# EAGLE design INK_TIME (EAGLE 9.7.0)

## Sheet 1 of 2
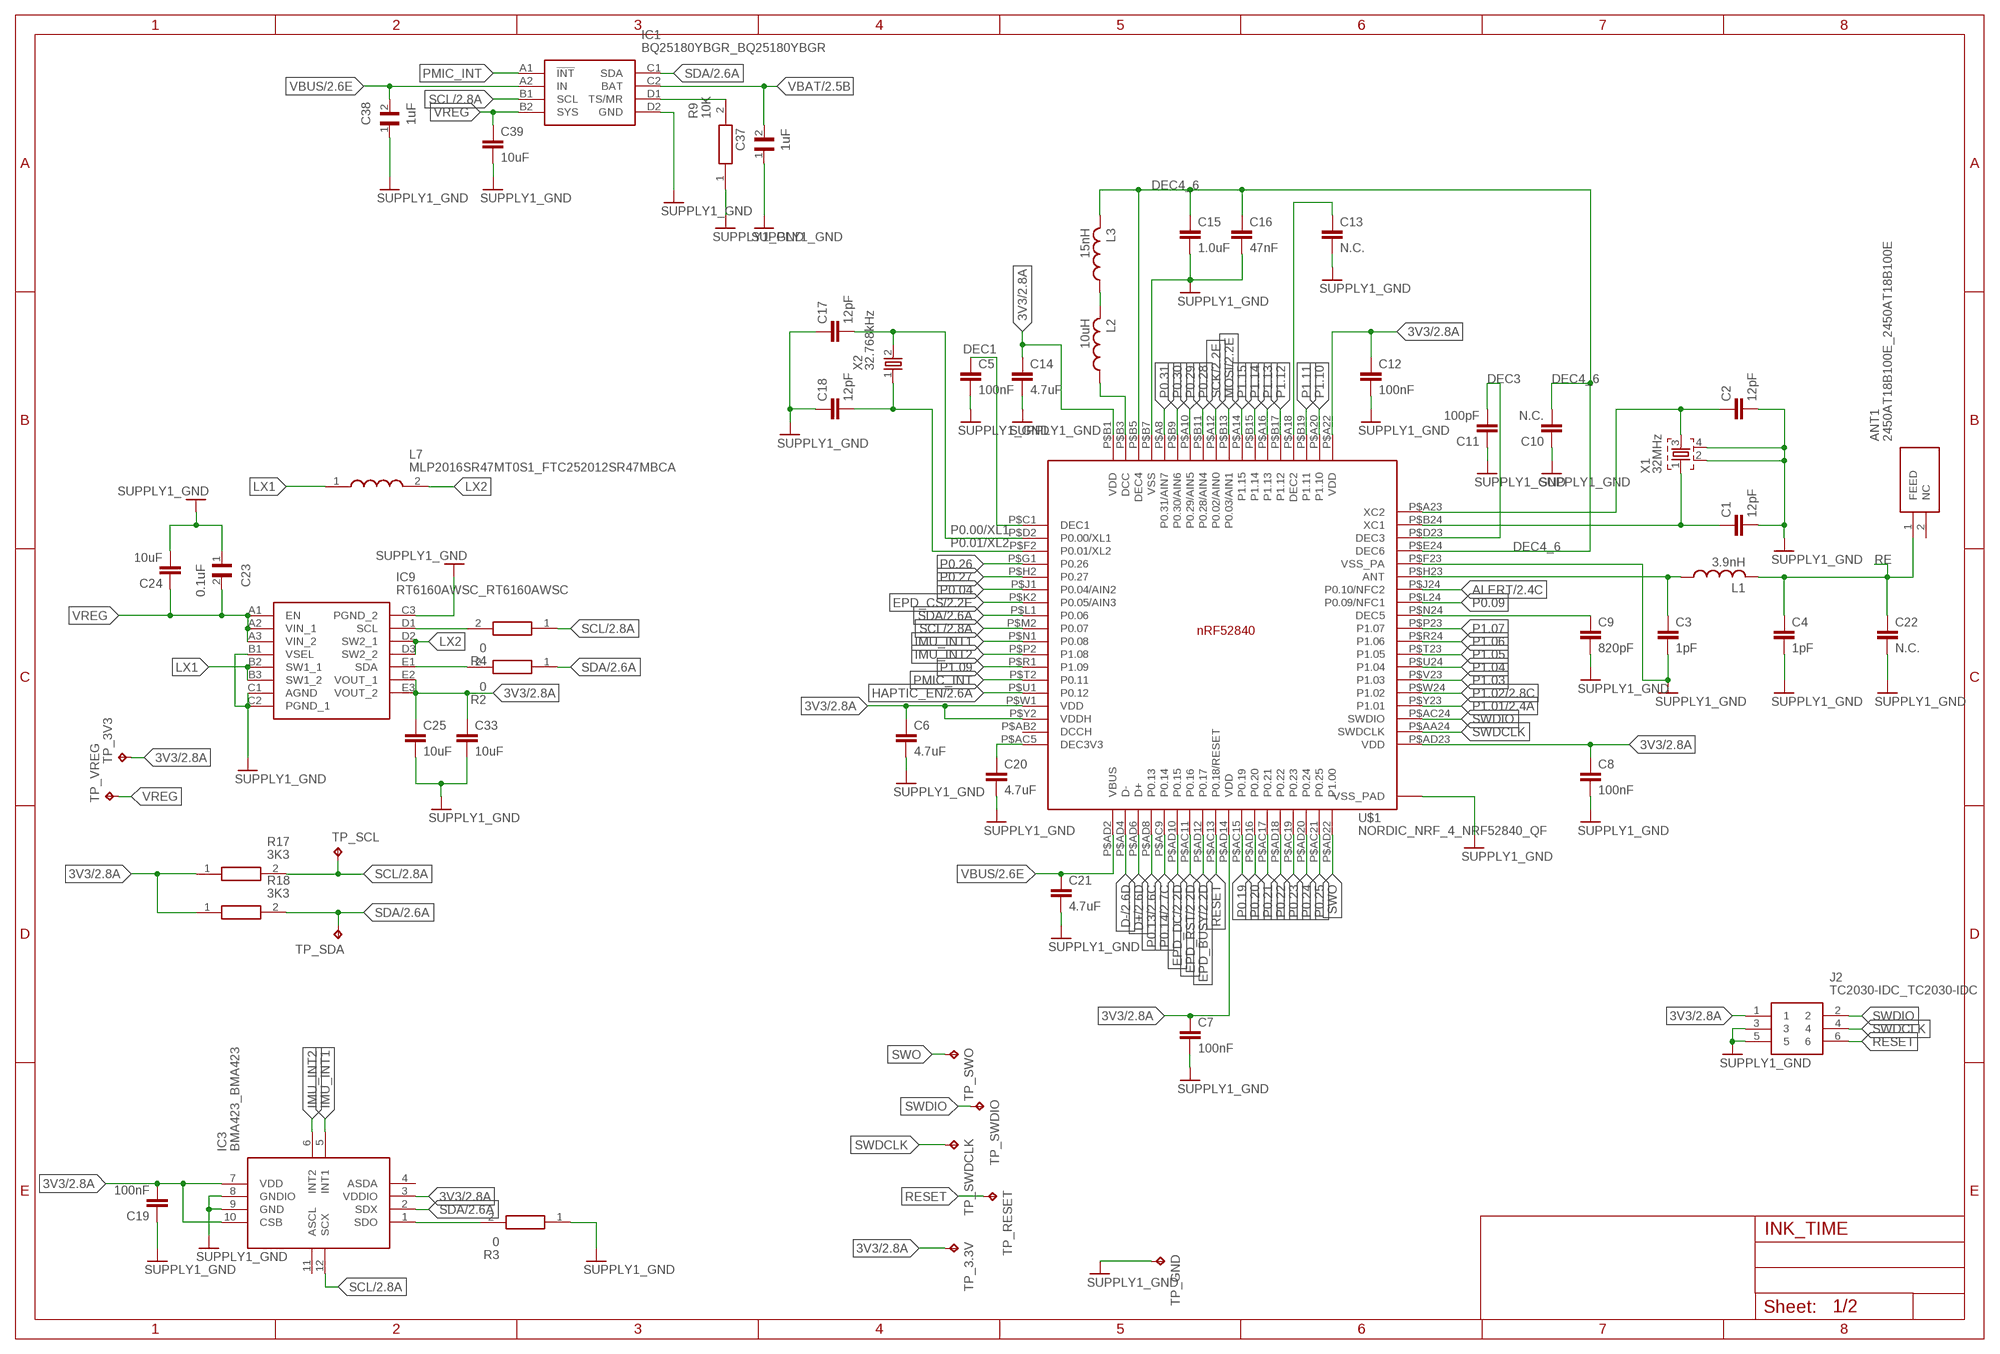
[diagram p0: schematic, sheet 1]

### Parts
ANT1  2450AT18B100E_2450AT18B100E  [2450AT18B100E_ANTC3216X140N]
C1  12pF  NORDIC_NRF_3_CAPACITOR_0201_L  [NORDIC_NRF_3_RESC0201_L]
C2  12pF  NORDIC_NRF_3_CAPACITOR_0201_L  [NORDIC_NRF_3_RESC0201_L]
C3  1pF  NORDIC_NRF_3_CAPACITOR_0201_L  [NORDIC_NRF_3_RESC0201_L]
C4  1pF  NORDIC_NRF_3_CAPACITOR_0201_L  [NORDIC_NRF_3_RESC0201_L]
C5  100nF  NORDIC_NRF_3_CAPACITOR_0201_L  [NORDIC_NRF_3_RESC0201_L]
C6  4.7uF  NORDIC_NRF_3_CAPACITOR_0402_L  [NORDIC_NRF_3_RESC0402_L]
C7  100nF  NORDIC_NRF_3_CAPACITOR_0201_L  [NORDIC_NRF_3_RESC0201_L]
C8  100nF  NORDIC_NRF_3_CAPACITOR_0201_L  [NORDIC_NRF_3_RESC0201_L]
C9  820pF  NORDIC_NRF_3_CAPACITOR_0201_L  [NORDIC_NRF_3_RESC0201_L]
C10  N.C.  NORDIC_NRF_3_CAPACITOR_0201_L  [NORDIC_NRF_3_RESC0201_L]
C11  100pF  NORDIC_NRF_3_CAPACITOR_0201_L  [NORDIC_NRF_3_RESC0201_L]
C12  100nF  NORDIC_NRF_3_CAPACITOR_0201_L  [NORDIC_NRF_3_RESC0201_L]
C13  N.C.  NORDIC_NRF_3_CAPACITOR_0201_L  [NORDIC_NRF_3_RESC0201_L]
C14  4.7uF  NORDIC_NRF_3_CAPACITOR_0402_L  [NORDIC_NRF_3_RESC0402_L]
C15  1.0uF  NORDIC_NRF_3_CAPACITOR_0402_L  [NORDIC_NRF_3_RESC0402_L]
C16  47nF  NORDIC_NRF_3_CAPACITOR_0201_L  [NORDIC_NRF_3_RESC0201_L]
C17  12pF  NORDIC_NRF_3_CAPACITOR_0201_L  [NORDIC_NRF_3_RESC0201_L]
C18  12pF  NORDIC_NRF_3_CAPACITOR_0201_L  [NORDIC_NRF_3_RESC0201_L]
C19  100nF  NORDIC_NRF_3_CAPACITOR_0201_L  [NORDIC_NRF_3_RESC0201_L]
C20  4.7uF  NORDIC_NRF_3_CAPACITOR_0402_L  [NORDIC_NRF_3_RESC0402_L]
C21  4.7uF  NORDIC_NRF_3_CAPACITOR_0402_L  [NORDIC_NRF_3_RESC0402_L]
C22  N.C.  NORDIC_NRF_3_CAPACITOR_0201_L  [NORDIC_NRF_3_RESC0201_L]
C23  0.1uF  GRM011R60J152KE01L_1_GRM011R60J152KE01L  [GRM011R60J152KE01L_1_0201]
C24  10uF  NORDIC_NRF_3_CAPACITOR_0402_L  [NORDIC_NRF_3_RESC0402_L]
C25  10uF  NORDIC_NRF_3_CAPACITOR_0402_L  [NORDIC_NRF_3_RESC0402_L]
C33  10uF  NORDIC_NRF_3_CAPACITOR_0402_L  [NORDIC_NRF_3_RESC0402_L]
C37  1uF  GRM011R60J152KE01L_1_GRM011R60J152KE01L  [GRM011R60J152KE01L_1_0201]
C38  1uF  GRM011R60J152KE01L_1_GRM011R60J152KE01L  [GRM011R60J152KE01L_1_0201]
C39  10uF  NORDIC_NRF_3_CAPACITOR_0402_L  [NORDIC_NRF_3_RESC0402_L]
IC1  BQ25180YBGR_BQ25180YBGR  [BQ25180YBGR_BGA8C40P2X4_100X155X50]
IC3  BMA423_BMA423  [BMA423_BMA423]
IC9  RT6160AWSC_RT6160AWSC  [RT6160AWSC_BGA15C40P3X5_140X230X60]
J2  TC2030-IDC_TC2030-IDC  [TC2030-IDC_TC2030IDC]
L1  3.9nH  NORDIC_NRF_2_INDUCTOR_0402_L  [NORDIC_NRF_2_RESC0402_L]
L2  10uH  NORDIC_NRF_2_INDUCTOR_0402_L  [NORDIC_NRF_2_RESC0402_L]
L3  15nH  NORDIC_NRF_2_INDUCTOR_0402_L  [NORDIC_NRF_2_RESC0402_L]
L7  MLP2016SR47MT0S1_FTC252012SR47MBCA  [MLP2016SR47MT0S1_INDC2016X100N]
R2  0  CPF0201D7K68C1_CPF0201D7K68C1  [CPF0201D7K68C1_0201]
R3  0  CPF0201D7K68C1_CPF0201D7K68C1  [CPF0201D7K68C1_0201]
R4  0  CPF0201D7K68C1_CPF0201D7K68C1  [CPF0201D7K68C1_0201]
R9  10K  CPF0201D7K68C1_CPF0201D7K68C1  [CPF0201D7K68C1_0201]
R17  3K3  CPF0201D7K68C1_CPF0201D7K68C1  [CPF0201D7K68C1_0201]
R18  3K3  CPF0201D7K68C1_CPF0201D7K68C1  [CPF0201D7K68C1_0201]
TP_3.3V  HECTOR_WATCH_1_TPTP20R  [HECTOR_WATCH_1_TP20R]
TP_3V3  HECTOR_WATCH_1_TPTP20R  [HECTOR_WATCH_1_TP20R]
TP_GND  HECTOR_WATCH_1_TPTP20R  [HECTOR_WATCH_1_TP20R]
TP_RESET  HECTOR_WATCH_1_TPTP20R  [HECTOR_WATCH_1_TP20R]
TP_SCL  HECTOR_WATCH_1_TPTP20R  [HECTOR_WATCH_1_TP20R]
TP_SDA  HECTOR_WATCH_1_TPTP20R  [HECTOR_WATCH_1_TP20R]
TP_SWDCLK  HECTOR_WATCH_1_TPTP20R  [HECTOR_WATCH_1_TP20R]
TP_SWDIO  HECTOR_WATCH_1_TPTP20R  [HECTOR_WATCH_1_TP20R]
TP_SWO  HECTOR_WATCH_1_TPTP20R  [HECTOR_WATCH_1_TP20R]
TP_VREG  HECTOR_WATCH_1_TPTP20R  [HECTOR_WATCH_1_TP20R]
U$1  NORDIC_NRF_4_NRF52840_QF  [NORDIC_NRF_4_AQFN50P700X700X85_HS-74N]
X1  32MHz  NORDIC_NRF_XTAL_32MHZ  [NORDIC_NRF_BT-XTAL_2016_N]
X2  32.768kHz  NORDIC_NRF_1_XTAL_32KHZ  [NORDIC_NRF_1_XTAL_3215_N]

### Nets
3V3: C6.1 C7.1 C8.1 C12.1 C14.1 C19.2 C25.1 C33.1 IC3.3(VDDIO) IC3.7(VDD) IC3.10(CSB) IC9.E2(VOUT_1) IC9.E3(VOUT_2) J2.1 R17.1 R18.1 TP_3.3V.TP TP_3V3.TP U$1.P$A22(VDD) U$1.P$AD14(VDD) U$1.P$AD23(VDD) U$1.P$B1(VDD) U$1.P$W1(VDD) U$1.P$Y2(VDDH) ; also sheet 2
ALERT: U$1.P$J24(P0.10/NFC2) ; also sheet 2
D+: U$1.P$AD6(D+) ; also sheet 2
D-: U$1.P$AD4(D-) ; also sheet 2
DEC1: C5.1 U$1.P$C1(DEC1)
DEC3: C11.2 U$1.P$D23(DEC3)
DEC4_6: C10.2 C15.1 C16.1 L3.2 U$1.P$B5(DEC4) U$1.P$E24(DEC6)
EPD_BUSY: U$1.P$AD12(P0.17) ; also sheet 2
EPD_CS: U$1.P$K2(P0.05/AIN3) ; also sheet 2
EPD_DC: U$1.P$AD10(P0.15) ; also sheet 2
EPD_RST: U$1.P$AC11(P0.16) ; also sheet 2
GND: C1.2 C2.2 C3.2 C4.2 C5.2 C6.2 C7.2 C8.2 C9.2 C10.1 C11.1 C12.2 C13.2 C14.2 C15.2 C16.2 C17.1 C18.1 C19.1 C20.2 C21.2 C22.2 C23.1 C24.2 C25.2 C33.2 C37.1 C38.1 C39.2 IC1.D2(GND) IC3.8(GNDIO) IC3.9(GND) IC9.B1(VSEL) IC9.C1(AGND) IC9.C2(PGND_1) IC9.C3(PGND_2) J2.3 J2.5 R3.1 R9.1 TP_GND.TP U$1.P$74(VSS_PAD) U$1.P$75(VSS_PAD) U$1.P$76(VSS_PAD) U$1.P$77(VSS_PAD) U$1.P$78(VSS_PAD) U$1.P$79(VSS_PAD) U$1.P$80(VSS_PAD) U$1.P$81(VSS_PAD) U$1.P$82(VSS_PAD) U$1.P$83(VSS_PAD) U$1.P$84(VSS_PAD) U$1.P$85(VSS_PAD) U$1.P$86(VSS_PAD) U$1.P$87(VSS_PAD) U$1.P$88(VSS_PAD) U$1.P$89(VSS_PAD) U$1.P$90(VSS_PAD) U$1.P$B7(VSS) U$1.P$F23(VSS_PA) X1.2 X1.4 ; supply symbol labelled SUPPLY1_GND ; also sheet 2
HAPTIC_EN: U$1.P$U1(P0.12) ; also sheet 2
IMU_INT1: IC3.5(INT1) U$1.P$N1(P0.08)
IMU_INT2: IC3.6(INT2) U$1.P$P2(P1.08)
LX1: IC9.B2(SW1_1) IC9.B3(SW1_2) L7.1
LX2: IC9.D2(SW2_1) IC9.D3(SW2_2) L7.2
MOSI: U$1.P$B13(P0.03/AIN1) ; also sheet 2
N$1: C1.1 U$1.P$B24(XC1) X1.1
N$2: C2.1 U$1.P$A23(XC2) X1.3
N$3: IC1.D1(TS/MR) R9.2
N$4: IC9.D1(SCL) R4.2
N$5: C3.1 L1.1 U$1.P$H23(ANT)
N$6: C20.1 U$1.P$AC5(DEC3V3)
N$7: L2.1 U$1.P$B3(DCC)
N$8: C9.1 U$1.P$N24(DEC5)
N$9: IC9.E1(SDA) R2.2
N$10: IC3.1(SDO) R3.2
N$11: L2.2 L3.1
N$21: C13.1 U$1.P$A18(DEC2)
P0.00/XL1: C17.2 U$1.P$D2(P0.00/XL1) X2.2
P0.01/XL2: C18.2 U$1.P$F2(P0.01/XL2) X2.1
P0.04: U$1.P$J1(P0.04/AIN2)
P0.09: U$1.P$L24(P0.09/NFC1)
P0.13: U$1.P$AD8(P0.13) ; also sheet 2
P0.14: U$1.P$AC9(P0.14) ; also sheet 2
P0.19: U$1.P$AC15(P0.19)
P0.20: U$1.P$AD16(P0.20)
P0.21: U$1.P$AC17(P0.21)
P0.22: U$1.P$AD18(P0.22)
P0.23: U$1.P$AC19(P0.23)
P0.24: U$1.P$AD20(P0.24)
P0.25: U$1.P$AC21(P0.25)
P0.26: U$1.P$G1(P0.26)
P0.27: U$1.P$H2(P0.27)
P0.28: U$1.P$B11(P0.28/AIN4)
P0.29: U$1.P$A10(P0.29/AIN5)
P0.30: U$1.P$B9(P0.30/AIN6)
P0.31: U$1.P$A8(P0.31/AIN7)
P1.01: U$1.P$Y23(P1.01) ; also sheet 2
P1.02: U$1.P$W24(P1.02) ; also sheet 2
P1.03: U$1.P$V23(P1.03)
P1.04: U$1.P$U24(P1.04)
P1.05: U$1.P$T23(P1.05)
P1.06: U$1.P$R24(P1.06)
P1.07: U$1.P$P23(P1.07)
P1.09: U$1.P$R1(P1.09)
P1.10: U$1.P$A20(P1.10)
P1.11: U$1.P$B19(P1.11)
P1.12: U$1.P$B17(P1.12)
P1.13: U$1.P$A16(P1.13)
P1.14: U$1.P$B15(P1.14)
P1.15: U$1.P$A14(P1.15)
PMIC_INT: IC1.A1(!INT) U$1.P$T2(P0.11)
RE: ANT1.1(FEED) C4.1 C22.1 L1.2
RESET: J2.6 TP_RESET.TP U$1.P$AC13(P0.18/RESET)
SCK: U$1.P$A12(P0.02/AIN0) ; also sheet 2
SCL: IC1.B1(SCL) IC3.12(SCX) R4.1 R17.2 TP_SCL.TP U$1.P$M2(P0.07) ; also sheet 2
SDA: IC1.C1(SDA) IC3.2(SDX) R2.1 R18.2 TP_SDA.TP U$1.P$L1(P0.06) ; also sheet 2
SWDCLK: J2.4 TP_SWDCLK.TP U$1.P$AA24(SWDCLK)
SWDIO: J2.2 TP_SWDIO.TP U$1.P$AC24(SWDIO)
SWO: TP_SWO.TP U$1.P$AD22(P1.00)
VBAT: C37.2 IC1.C2(BAT) ; also sheet 2
VBUS: C21.1 C38.2 IC1.A2(IN) U$1.P$AD2(VBUS) ; also sheet 2
VREG: C23.2 C24.1 C39.1 IC1.B2(SYS) IC9.A1(EN) IC9.A2(VIN_1) IC9.A3(VIN_2) TP_VREG.TP
Unconnected: ANT1.2(NC) IC3.4(ASDA) IC3.11(ASCL) U$1.P$AB2(DCCH)

## Sheet 2 of 2
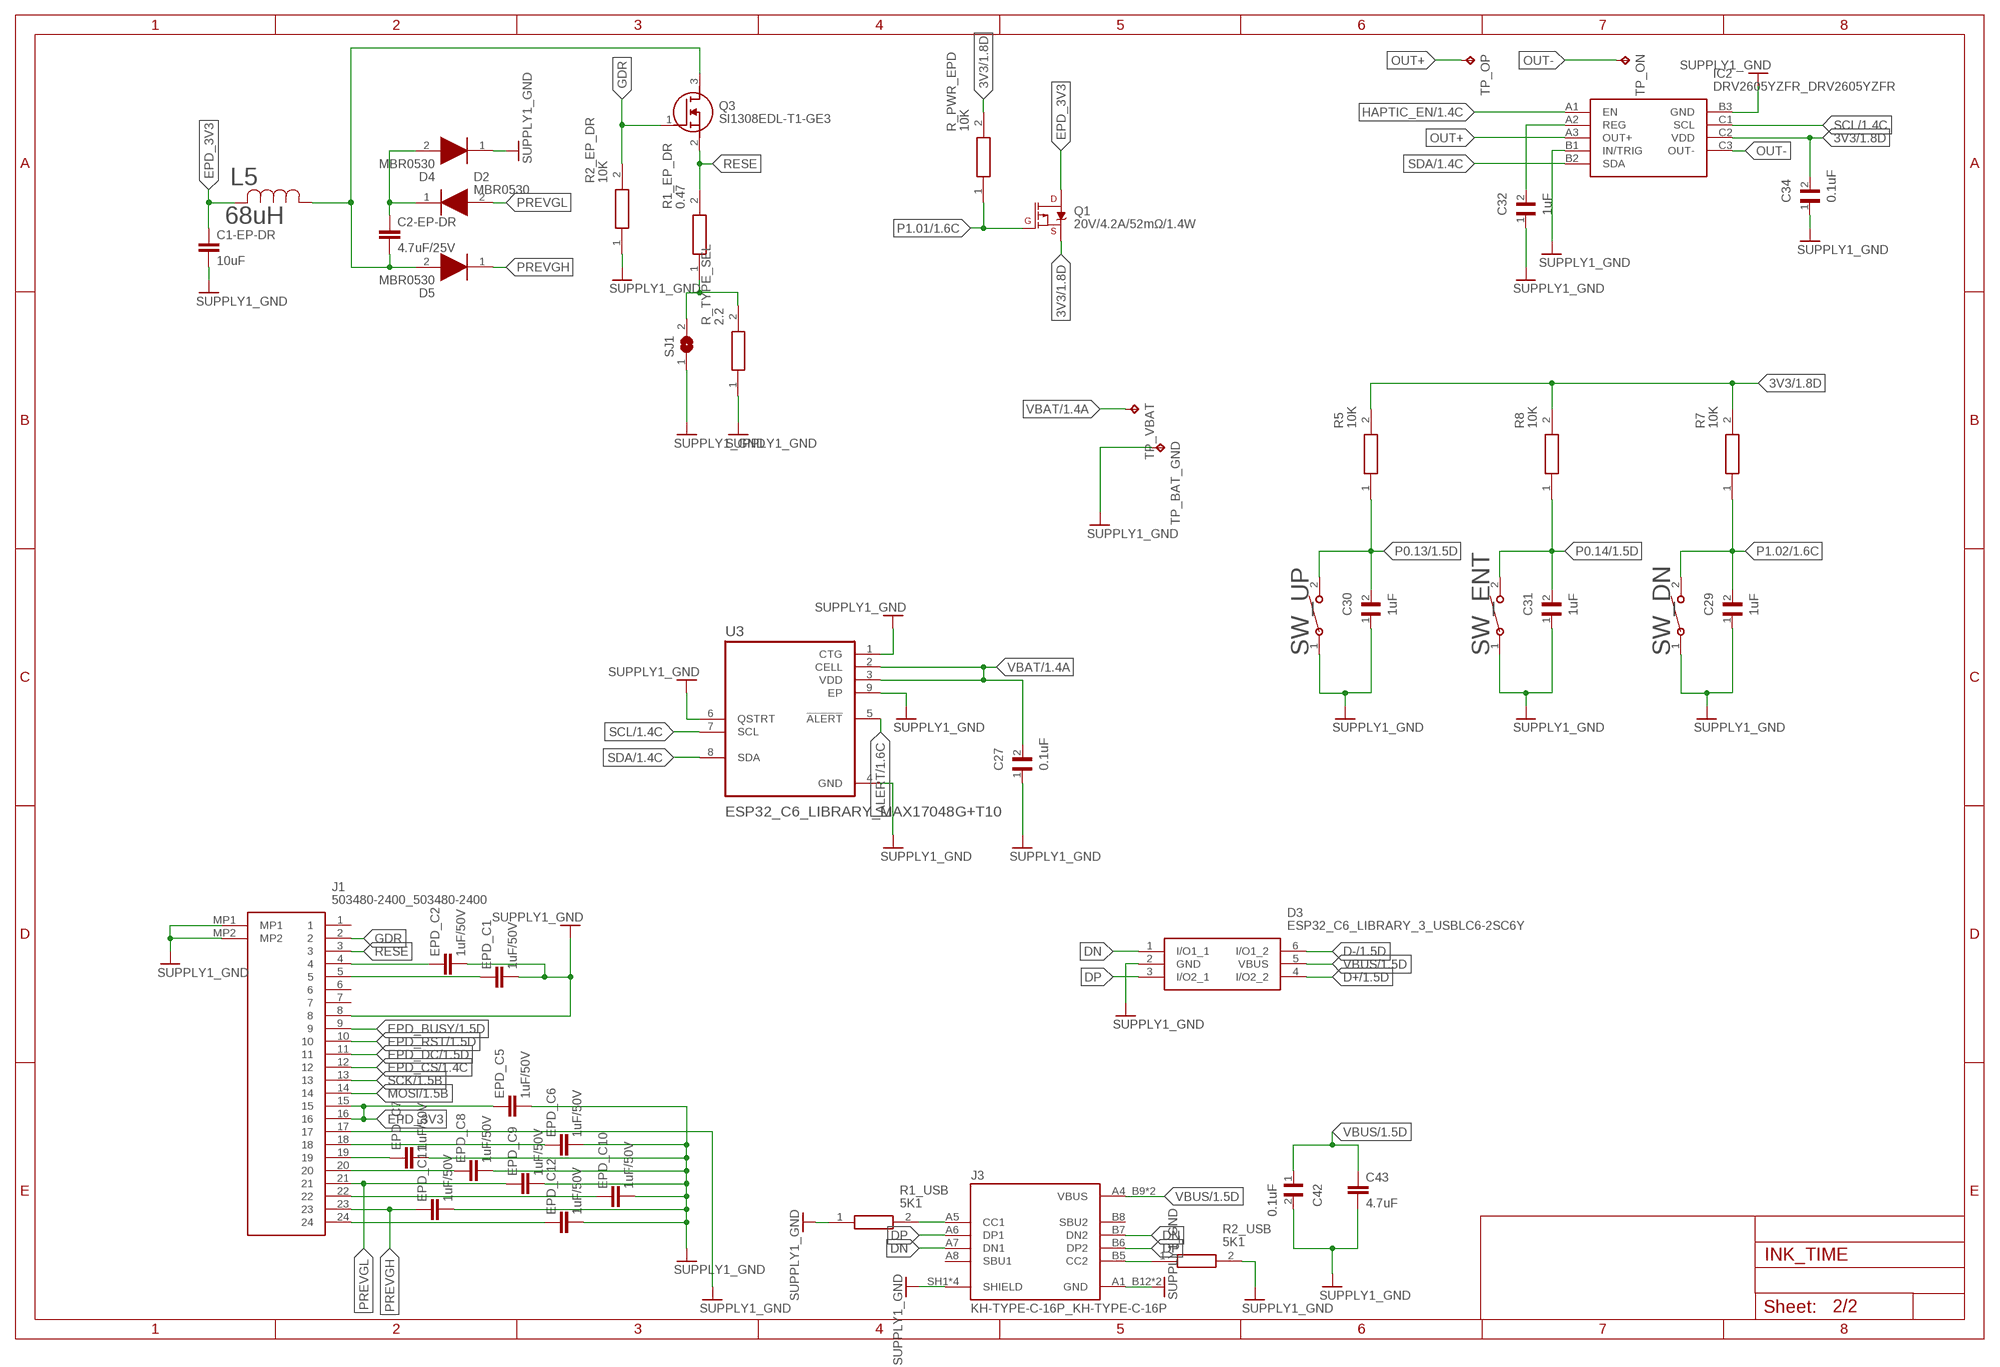
[diagram p1: schematic, sheet 2]

### Parts
C1-EP-DR  10uF  NORDIC_NRF_3_CAPACITOR_0402_L  [NORDIC_NRF_3_RESC0402_L]
C2-EP-DR  4.7uF/25V  NORDIC_NRF_3_CAPACITOR_0402_L  [NORDIC_NRF_3_RESC0402_L]
C27  0.1uF  GRM011R60J152KE01L_1_GRM011R60J152KE01L  [GRM011R60J152KE01L_1_0201]
C29  1uF  GRM011R60J152KE01L_1_GRM011R60J152KE01L  [GRM011R60J152KE01L_1_0201]
C30  1uF  GRM011R60J152KE01L_1_GRM011R60J152KE01L  [GRM011R60J152KE01L_1_0201]
C31  1uF  GRM011R60J152KE01L_1_GRM011R60J152KE01L  [GRM011R60J152KE01L_1_0201]
C32  1uF  GRM011R60J152KE01L_1_GRM011R60J152KE01L  [GRM011R60J152KE01L_1_0201]
C34  0.1uF  GRM011R60J152KE01L_1_GRM011R60J152KE01L  [GRM011R60J152KE01L_1_0201]
C42  0.1uF  GRM011R60J152KE01L_1_GRM011R60J152KE01L  [GRM011R60J152KE01L_1_0201]
C43  4.7uF  NORDIC_NRF_3_CAPACITOR_0402_L  [NORDIC_NRF_3_RESC0402_L]
D2  MBR0530  ESP32_C6_LIBRARY_5_MBR0530  [ESP32_C6_LIBRARY_5_SOD3716X135N]
D3  ESP32_C6_LIBRARY_3_USBLC6-2SC6Y  [ESP32_C6_LIBRARY_3_SOT95P280X145-6N]
D4  MBR0530  ESP32_C6_LIBRARY_5_MBR0530  [ESP32_C6_LIBRARY_5_SOD3716X135N]
D5  MBR0530  ESP32_C6_LIBRARY_5_MBR0530  [ESP32_C6_LIBRARY_5_SOD3716X135N]
EPD_C1  1uF/50V  NORDIC_NRF_3_CAPACITOR_0402_L  [NORDIC_NRF_3_RESC0402_L]
EPD_C2  1uF/50V  NORDIC_NRF_3_CAPACITOR_0402_L  [NORDIC_NRF_3_RESC0402_L]
EPD_C5  1uF/50V  NORDIC_NRF_3_CAPACITOR_0402_L  [NORDIC_NRF_3_RESC0402_L]
EPD_C6  1uF/50V  NORDIC_NRF_3_CAPACITOR_0402_L  [NORDIC_NRF_3_RESC0402_L]
EPD_C7  1uF/50V  NORDIC_NRF_3_CAPACITOR_0402_L  [NORDIC_NRF_3_RESC0402_L]
EPD_C8  1uF/50V  NORDIC_NRF_3_CAPACITOR_0402_L  [NORDIC_NRF_3_RESC0402_L]
EPD_C9  1uF/50V  NORDIC_NRF_3_CAPACITOR_0402_L  [NORDIC_NRF_3_RESC0402_L]
EPD_C10  1uF/50V  NORDIC_NRF_3_CAPACITOR_0402_L  [NORDIC_NRF_3_RESC0402_L]
EPD_C11  1uF/50V  NORDIC_NRF_3_CAPACITOR_0402_L  [NORDIC_NRF_3_RESC0402_L]
EPD_C12  1uF/50V  NORDIC_NRF_3_CAPACITOR_0402_L  [NORDIC_NRF_3_RESC0402_L]
IC2  DRV2605YZFR_DRV2605YZFR  [DRV2605YZFR_BGA9C50P3X3_144X144X62]
J1  503480-2400_503480-2400  [503480-2400_5034802400]
J3  KH-TYPE-C-16P_KH-TYPE-C-16P  [KH-TYPE-C-16P_KINGHELM_KH-TYPE-C-16P]
L5  68uH  ESP32_C6_LIBRARY_2_744043680IND_4828-WE-TPC_WRE  [ESP32_C6_LIBRARY_2_IND_4828-WE-TPC_WRE]
Q1  20V/4.2A/52mΩ/1.4W  ESP32_C6_LIBRARY_4_ESP32_WROVER_SPARKFUN-DISCRETESEMI_MOSFET_PCH-DMG2305UX-7  [ESP32_C6_LIBRARY_4_ESP32_C6_LIBRARY_4_ESP32_C6_LIBRARY_4_ESP32_C6_LIBRARY_4_ESP32_WROVER_SPARKFUN-DISCRETESEMI_SOT23-3]
Q3  SI1308EDL-T1-GE3  ESP32_C6_LIBRARY_6_SI1308EDL-T1-GE3  [ESP32_C6_LIBRARY_6_SOT65P210X110-3N]
R1_EP_DR  0.47  CPF0201D7K68C1_CPF0201D7K68C1  [CPF0201D7K68C1_0201]
R1_USB  5K1  CPF0201D7K68C1_CPF0201D7K68C1  [CPF0201D7K68C1_0201]
R2_EP_DR  10K  CPF0201D7K68C1_CPF0201D7K68C1  [CPF0201D7K68C1_0201]
R2_USB  5K1  CPF0201D7K68C1_CPF0201D7K68C1  [CPF0201D7K68C1_0201]
R5  10K  CPF0201D7K68C1_CPF0201D7K68C1  [CPF0201D7K68C1_0201]
R7  10K  CPF0201D7K68C1_CPF0201D7K68C1  [CPF0201D7K68C1_0201]
R8  10K  CPF0201D7K68C1_CPF0201D7K68C1  [CPF0201D7K68C1_0201]
R_PWR_EPD  10K  CPF0201D7K68C1_CPF0201D7K68C1  [CPF0201D7K68C1_0201]
R_TYPE_SEL  2.2  CPF0201D7K68C1_CPF0201D7K68C1  [CPF0201D7K68C1_0201]
SJ1  ESP32_C6_LIBRARY_7_JUMPER_SJ  [ESP32_C6_LIBRARY_7_JUMPER_SJ]
SW_DN  2025-10-22_07-23-44_LIBRARY_EVP-AKE31ASW_EVP-AKE31A_PAN  [2025-10-22_07-23-44_LIBRARY_SW_EVP-AKE31A_PAN]
SW_ENT  2025-10-22_07-23-44_LIBRARY_EVP-AKE31ASW_EVP-AKE31A_PAN  [2025-10-22_07-23-44_LIBRARY_SW_EVP-AKE31A_PAN]
SW_UP  2025-10-22_07-23-44_LIBRARY_EVP-AKE31ASW_EVP-AKE31A_PAN  [2025-10-22_07-23-44_LIBRARY_SW_EVP-AKE31A_PAN]
TP_BAT_GND  HECTOR_WATCH_1_TPTP20R  [HECTOR_WATCH_1_TP20R]
TP_ON  HECTOR_WATCH_1_TPTP20R  [HECTOR_WATCH_1_TP20R]
TP_OP  HECTOR_WATCH_1_TPTP20R  [HECTOR_WATCH_1_TP20R]
TP_VBAT  HECTOR_WATCH_1_TPTP20R  [HECTOR_WATCH_1_TP20R]
U3  ESP32_C6_LIBRARY_MAX17048G+T10  [ESP32_C6_LIBRARY_SON50P200X200X80-9N]

### Nets
3V3: C34.2 IC2.C2(VDD) Q1.2(S) R5.2 R7.2 R8.2 R_PWR_EPD.2 ; also sheet 1
ALERT: U3.5(!ALERT) ; also sheet 1
D+: D3.4(I/O2_2) ; also sheet 1
D-: D3.6(I/O1_2) ; also sheet 1
DN: D3.1(I/O1_1) J3.A7(DN1) J3.B7(DN2)
DP: D3.3(I/O2_1) J3.A6(DP1) J3.B6(DP2)
EPD_3V3: C1-EP-DR.1 EPD_C5.1 J1.15 J1.16 L5.2 Q1.3(D)
EPD_BUSY: J1.9 ; also sheet 1
EPD_CS: J1.12 ; also sheet 1
EPD_DC: J1.11 ; also sheet 1
EPD_RST: J1.10 ; also sheet 1
GDR: J1.2 Q3.1(G) R2_EP_DR.2
GND: C1-EP-DR.2 C27.1 C29.1 C30.1 C31.1 C32.1 C34.1 C42.2 C43.2 D3.2(GND) D4.1(K) EPD_C1.2 EPD_C2.2 EPD_C5.2 EPD_C6.2 EPD_C7.2 EPD_C8.2 EPD_C9.2 EPD_C10.2 EPD_C11.2 EPD_C12.2 IC2.B1(IN/TRIG) IC2.B3(GND) J1.8 J1.17 J1.MP1 J1.MP2 J3.A1_B12(GND) J3.A12_B1(GND) J3.SH1(SHIELD) J3.SH2(SHIELD) J3.SH3(SHIELD) J3.SH4(SHIELD) R1_USB.1 R2_EP_DR.1 R2_USB.2 R_TYPE_SEL.1 SJ1.1 SW_DN.1 SW_ENT.1 SW_UP.1 TP_BAT_GND.TP U3.1(CTG) U3.4(GND) U3.6(QSTRT) U3.9(EP) ; supply symbol labelled SUPPLY1_GND ; also sheet 1
HAPTIC_EN: IC2.A1(EN) ; also sheet 1
MOSI: J1.14 ; also sheet 1
N$12: C2-EP-DR.1 D2.1(K) D4.2(A)
N$13: C2-EP-DR.2 D5.2(A) L5.1 Q3.3(D)
N$14: R1_EP_DR.1 R_TYPE_SEL.2 SJ1.2
N$15: C32.2 IC2.A2(REG)
N$16: EPD_C2.1 J1.4
N$17: EPD_C1.1 J1.5
N$18: EPD_C7.1 J1.19
N$19: EPD_C6.1 J1.18
N$20: EPD_C8.1 J1.20
N$22: J3.B5(CC2) R2_USB.1
N$23: EPD_C10.1 J1.22
N$24: J3.A5(CC1) R1_USB.2
N$25: EPD_C12.1 J1.24
OUT+: IC2.A3(OUT+) TP_OP.TP
OUT-: IC2.C3(OUT-) TP_ON.TP
P0.13: C30.2 R5.1 SW_UP.2 ; also sheet 1
P0.14: C31.2 R8.1 SW_ENT.2 ; also sheet 1
P1.01: Q1.1(G) R_PWR_EPD.1 ; also sheet 1
P1.02: C29.2 R7.1 SW_DN.2 ; also sheet 1
PREVGH: D5.1(K) EPD_C11.1 J1.23
PREVGL: D2.2(A) EPD_C9.1 J1.21
RESE: J1.3 Q3.2(S) R1_EP_DR.2
SCK: J1.13 ; also sheet 1
SCL: IC2.C1(SCL) U3.7(SCL) ; also sheet 1
SDA: IC2.B2(SDA) U3.8(SDA) ; also sheet 1
VBAT: C27.2 TP_VBAT.TP U3.2(CELL) U3.3(VDD) ; also sheet 1
VBUS: C42.1 C43.1 D3.5(VBUS) J3.A4_B9(VBUS) J3.A9_B4(VBUS) ; also sheet 1
Unconnected: J1.1 J1.6 J1.7 J3.A8(SBU1) J3.B8(SBU2)

## Library data of the parts
ANT1 = InkTime_v5:2450AT18B100E_2450AT18B100E: Antennas 2.45GHz ANTENNA Source: Datasheet <https://www.johansontechnology.com/datasheets/2450AT18B100/2450AT18B100.pdf>
C1 C1-EP-DR C2 C2-EP-DR C3-C22 C24 C25 C33 C39 C43 EPD_C1 EPD_C2 EPD_C5-EPD_C12 = InkTime_v5:NORDIC_NRF_3_CAPACITOR: Generic chip capacitor
C23 C27 C29-C32 C34 C37 C38 C42 = InkTime_v5:GRM011R60J152KE01L_1_GRM011R60J152KE01L: Check availability <https://pricing.snapeda.com/parts/GRM011R60J152KE01L/Murata/view-part?ref=eda>
D2 D4 D5 = InkTime_v5:ESP32_C6_LIBRARY_5_MBR0530: ON SEMICONDUCTOR - MBR0530 - DIODE, SCHOTTKY, 0.5A, 30V, SOD-123 Source: Datasheet <http://www.onsemi.com/pub/Collateral/MBR0530T1-D.PDF> Check availability <https://pricing.snapeda.com/parts/MBR0530/ON%20Semiconductor/view-part?ref=eda>
D3 = InkTime_v5:ESP32_C6_LIBRARY_3_USBLC6-2SC6Y: Low Cap. ESD Protection Auto SOT-23-6 STMicroelectronics USBLC6-2SC6Y, Dual Uni-Directional TVS Diode Array, 6-Pin SOT-23 Source: Datasheet <https://componentsearchengine.com/Datasheets/1/USBLC6-2SC6Y.pdf> Check availability <https://pricing.snapeda.com/parts/USBLC6-2SC6Y/STMicroelectronics/view-part?ref=eda>
IC1 = InkTime_v5:BQ25180YBGR_BQ25180YBGR: Charger IC Lithium Ion/Polymer, Lithium Iron Phosphate 8-DSBGA (1.6x1.1) Source: Datasheet <https://www.ti.com/lit/ds/symlink/bq25180.pdf?ts=1650264094470&ref_url=https%3A%2F%2Fwww.ti.com%2Fproduct%2FBQ25180>
IC2 = InkTime_v5:DRV2605YZFR_DRV2605YZFR: Haptic Driver for ERM/LRA with Built-In Library and Smart Loop Architecture Source: Datasheet <http://www.ti.com/lit/gpn/drv2605>
IC3 = InkTime_v5:BMA423_BMA423: Accelerometers Triaxial low-g 12bit Acceleration Sensor Source: Datasheet <https://www.mouser.com/datasheet/2/783/BST-BMA423-DS000-1509600.pdf>
IC9 = InkTime_v5:RT6160AWSC_RT6160AWSC: Buck-Boost Regulator Positive Output Step-Up/Step-Down I2C DC-DC Controller IC 15-WL-CSP (BSC) (1.4x2.3) Source: Datasheet <https://www.richtek.com/SaveDownload.aspx?specid=RT6160A>
J1 = InkTime_v5:503480-2400_503480-2400: FFC & FPC Connectors 0.5mm FPC RA SMT Dual Contact 24Ckt Source: Datasheet <https://componentsearchengine.com/Datasheets/1/503480-2400.pdf>
J2 = InkTime_v5:TC2030-IDC_TC2030-IDC: CABLE ADAPTER 6 POS Source: Datasheet <https://datasheet.datasheetarchive.com/originals/distributors/Datasheets_SAMA/62bc384e093448baaaa63dbd0b9d8707.pdf>
J3 = InkTime_v5:KH-TYPE-C-16P_KH-TYPE-C-16P: Check availability <https://pricing.snapeda.com/parts/KH-TYPE-C-16P/kinghelm/view-part?ref=eda>
L1-L3 = InkTime_v5:NORDIC_NRF_2_INDUCTOR: Generic chip inductor
L5 = InkTime_v5:ESP32_C6_LIBRARY_2_744043680
L7 = InkTime_v5:MLP2016SR47MT0S1_FTC252012SR47MBCA: SMD / SMT Inductors (Coils), L=0.47?H, L x W x T : Source: Datasheet <https://product.tdk.com/system/files/dam/doc/product/inductor/inductor/smd/catalog/inductor_commercial_power_mlp2016_en.pdf>
Q1 = InkTime_v5:ESP32_C6_LIBRARY_4_ESP32_WROVER_SPARKFUN-DISCRETESEMI_MOSFET_PCH: P-channel MOSFETs Voltage controlled devices that allow control of high current outputs. SparkFun Products: SparkFun ESP32 Thing <https://www.sparkfun.com/products/13907> SparkFun ESP8266 Thing <https://www.sparkfun.com/products/13231> SparkFun Pi Servo HAT V2 <https://www.sparkfun.com/products/15316> DMG2305UX-7 (20V/4.2A/SOT23-3)
Q3 = InkTime_v5:ESP32_C6_LIBRARY_6_SI1308EDL-T1-GE3: MOSFET N-Ch 30V 1.5A TrenchFET SC70 Vishay Si1308EDL-T1-GE3 N-channel MOSFET Transistor, 1.5 A, 30 V, 3-Pin SC-70 Source: Datasheet <https://componentsearchengine.com/Datasheets/1/SI1308EDL-T1-GE3.pdf> Check availability <https://pricing.snapeda.com/parts/SI1308EDL-T1-GE3/Vishay%20Siliconix/view-part?ref=eda>
R1_EP_DR R1_USB R2 R2_EP_DR R2_USB R3-R5 R7-R9 R17 R18 R_PWR_EPD R_TYPE_SEL = InkTime_v5:CPF0201D7K68C1_CPF0201D7K68C1: 7.68k 0201 Thin Film Surface Mount Fixed Resistor +/-0.5% 0.031W CPF0201D7K68C1 Source: Datasheet <http://www.te.com/commerce/DocumentDelivery/DDEController?Action=showdoc&DocId=Data Sheet1773200-1ApdfEnglishENG_DS_1773200-1_A.pdf4-2176215-6>
SJ1 = InkTime_v5:ESP32_C6_LIBRARY_7_JUMPER_SJ: SMD solder JUMPER
SW_DN SW_ENT SW_UP = InkTime_v5:2025-10-22_07-23-44_LIBRARY_EVP-AKE31A
TP_3.3V TP_3V3 TP_BAT_GND TP_GND TP_ON TP_OP TP_RESET TP_SCL TP_SDA TP_SWDCLK TP_SWDIO TP_SWO TP_VBAT TP_VREG = InkTime_v5:HECTOR_WATCH_1_TP: Test pad
U3 = InkTime_v5:ESP32_C6_LIBRARY_MAX17048G+T10: Check availability <https://pricing.snapeda.com/parts/MAX17048G%2BT10/Analog%20Devices/view-part?ref=eda>
U$1 = InkTime_v5:NORDIC_NRF_4_NRF52840_QF: nRF52840 Features Advanced Single chip 2.4 GHz multi-protocol SoC 32-bit ARM Cortex-M4F Processor 1.7v to 5.5v operation 1MB flash + 256kB RAM Bluetooth 5 support for long range and high throughput 802.15.4 radio support On-chip NFC PPI –Programmable Peripheral Interconnect Automated power management system with automatic power management of each peripheral Configurable I/O mapping for analog and digital I/O 48 x GPIO 1 x QSPI 4 x Master/Slave SPI 2 x Two-wire interface (I²C) I²S interface 2 x UART 4 x PWM USB 2.0 controller ARM TrustZone CryptoCell-310 Cryptographic and security module AES 128-bit ECB/CCM/AAR hardware accelerator Digital microphone interface (PDM) Quadrature decoder 12-bit ADC Low power comparator On-chip 50Ω balun On-air compatible with nRF52, nRF51 and nRF24 Series Applications Advanced high performance wearables Wearables for secure payments Virtual Reality/Augmented Reality systems Smart Home sensor networks Smart city sensor networks High performance HID controllers Internet of Things (IoT) sensor networks Smart door locks Smart lighting networks Connected white goods
X1 = InkTime_v5:NORDIC_NRF_XTAL_32MHZ
X2 = InkTime_v5:NORDIC_NRF_1_XTAL_32KHZ

## Board
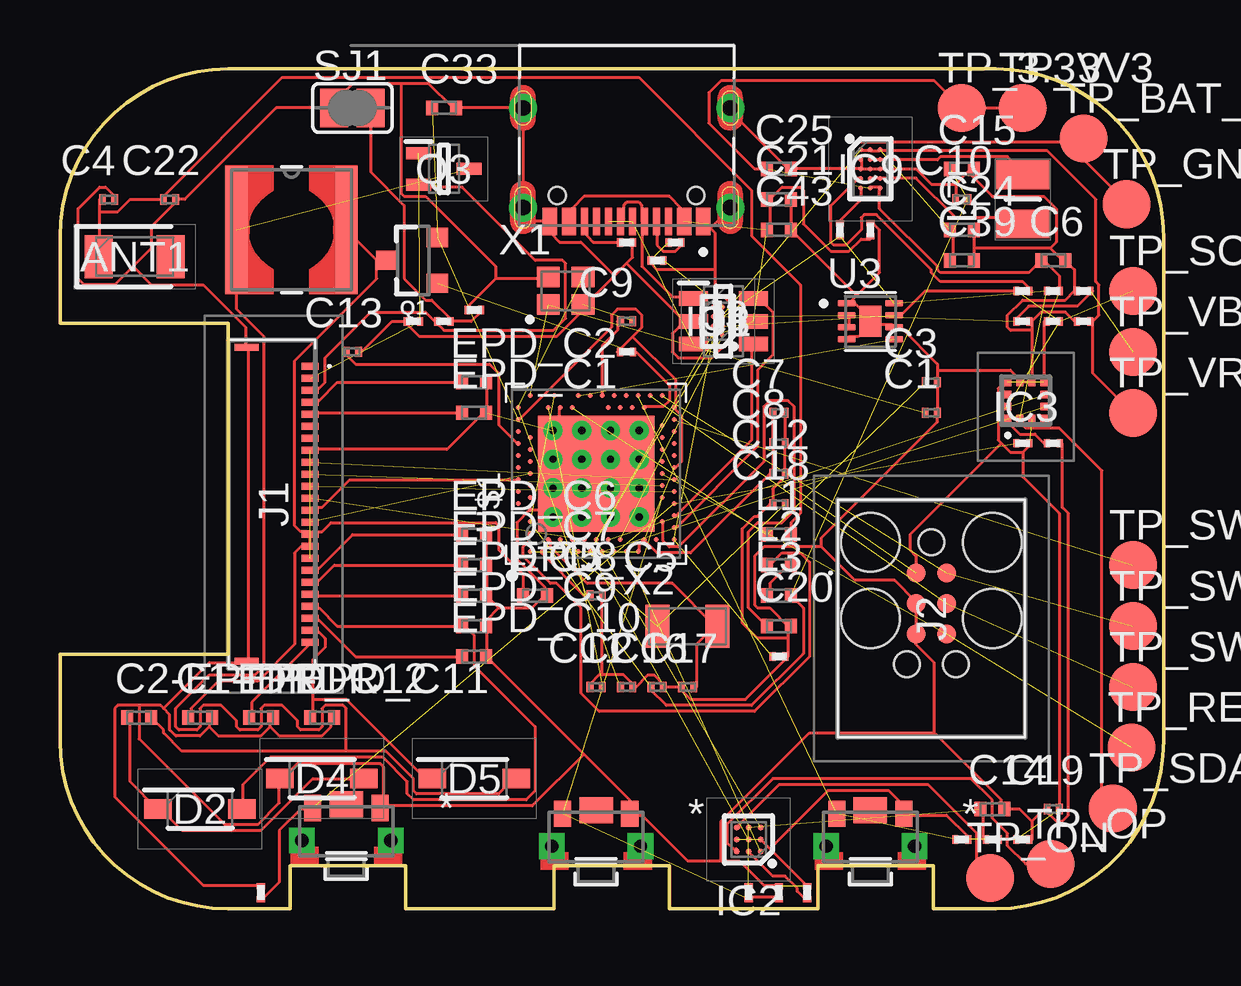
[diagram p2: board, top side]
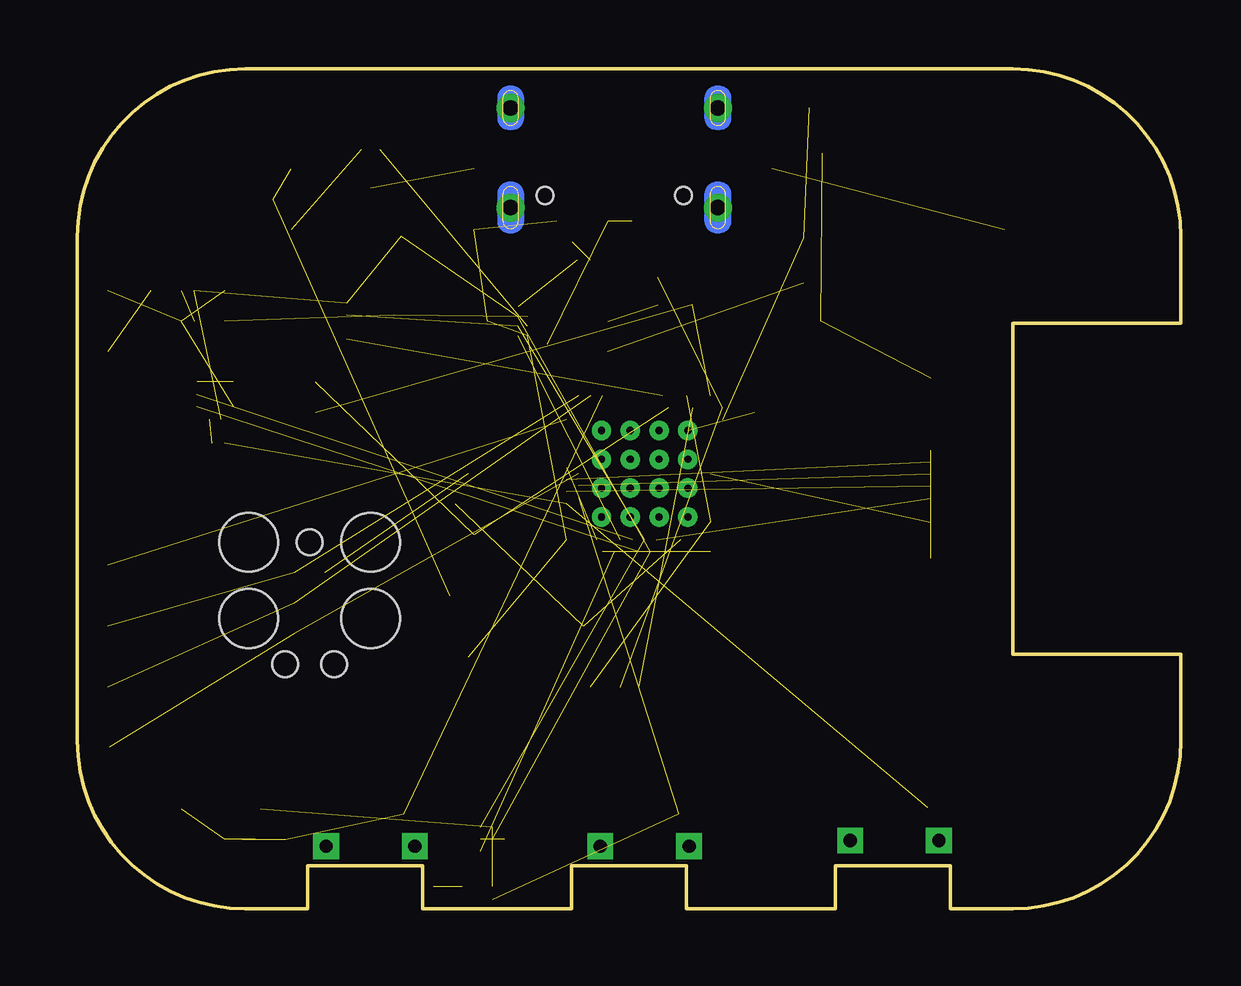
[diagram p3: board, bottom side, seen from below]

Size 46 x 35 mm. Coordinates in mm from the lower left corner, seen from the top.
Outline: 39,0 36.4,0 36.4,1.8 31.6,1.8 31.6,0 25.4,0 25.4,1.8 20.6,1.8 20.6,0 14.4,0 14.4,1.8 9.6,1.8 9.6,0 7,0 arc-90 0,7 0,10.6 7,10.6 7,24.4 0,24.4 0,28 arc-90 7,35 39,35 arc-90 46,28 46,7 arc-90 39,0
Copper layers (1*16): Top / Bottom
Stack-up Default Layer Stack: Top User Defined 0.035mm / Dielectric-1 Core:085 0.914mm / Bottom User Defined 0.035mm
Design rules: minimum copper width 5mil, minimum drill size 0.3mm, copper clearance wire_polygon to wire_polygon 5mil, copper clearance wire_polygon to pad_smd 5mil, copper clearance wire_polygon to via 5mil, copper clearance pad_smd to pad_smd 5mil, copper clearance pad_smd to via 5mil, copper clearance via to via 5mil, copper clearance smd to pad (same net) 5mil, copper clearance smd to via (same net) 5mil, copper clearance smd to smd (same net) 5mil, dimension clearance 0.2mm, via restrict clearance 0mil, restrict clearance 0mil, drill distance 6mil, keepout clearance 0mil

### Footprints (pad centres in the part's own frame; a part is rotated, then mirrored left to right if it is on the bottom)
2450AT18B100E_ANTC3216X140N = smd 1.15 x 1.8: 1 -1.5,0; 2 1.5,0
NORDIC_NRF_3_RESC0201_L = smd 0.28 x 0.43: 1 -0.255,0; 2 0.255,0
NORDIC_NRF_3_RESC0402_L = smd 0.5 x 0.6: 1 -0.5,0; 2 0.5,0
GRM011R60J152KE01L_1_0201 = smd 0.35 x 0.25: 1 0,0.275; 2 0,-0.275
ESP32_C6_LIBRARY_5_SOD3716X135N = smd 1.15 x 0.8: 1 -1.75,0; 2 1.75,0
ESP32_C6_LIBRARY_3_SOT95P280X145-6N = smd 1.2 x 0.6: 1 -1.25,0.95; 2 -1.25,0; 3 -1.25,-0.95; 4 1.25,-0.95; 5 1.25,0; 6 1.25,0.95
BQ25180YBGR_BGA8C40P2X4_100X155X50 = smd 0.2 x 0.2: A1 -0.2,0.6; A2 0.2,0.6; B1 -0.2,0.2; B2 0.2,0.2; C1 -0.2,-0.2; C2 0.2,-0.2; D1 -0.2,-0.6; D2 0.2,-0.6
DRV2605YZFR_BGA9C50P3X3_144X144X62 = smd 0.25 x 0.25: A1 -0.5,0.5; A2 0,0.5; A3 0.5,0.5; B1 -0.5,0; B2 0,0; B3 0.5,0; C1 -0.5,-0.5; C2 0,-0.5; C3 0.5,-0.5
BMA423_BMA423 = smd 0.3 x 0.35: 1 -0.75,-0.775; 2 -0.25,-0.775; 3 0.25,-0.775; 4 0.75,-0.775; 7 0.75,0.775; 8 0.25,0.775; 9 -0.25,0.775; 10 -0.75,0.775 | smd 0.35 x 0.3: 5 0.775,-0.25; 6 0.775,0.25; 11 -0.775,0.25; 12 -0.775,-0.25
RT6160AWSC_BGA15C40P3X5_140X230X60 = smd 0.216 x 0.216: A1 -0.4,0.8; A2 0,0.8; A3 0.4,0.8; B1 -0.4,0.4; B2 0,0.4; B3 0.4,0.4; C1 -0.4,0; C2 0,0; C3 0.4,0; D1 -0.4,-0.4; D2 0,-0.4; D3 0.4,-0.4; E1 -0.4,-0.8; E2 0,-0.8; E3 0.4,-0.8
503480-2400_5034802400 = smd 0.3 x 0.7: 1 -5.75,1.525; 2 -5.25,1.525; 3 -4.75,1.525; 4 -4.25,1.525; 5 -3.75,1.525; 6 -3.25,1.525; 7 -2.75,1.525; 8 -2.25,1.525; 9 -1.75,1.525; 10 -1.25,1.525; 11 -0.75,1.525; 12 -0.25,1.525; 13 0.25,1.525; 14 0.75,1.525; 15 1.25,1.525; 16 1.75,1.525; 17 2.25,1.525; 18 2.75,1.525; 19 3.25,1.525; 20 3.75,1.525; 21 4.25,1.525; 22 4.75,1.525; 23 5.25,1.525; 24 5.75,1.525 | smd 0.3 x 1: MP1 -6.54,-1.125; MP2 6.54,-1.125
TC2030-IDC_TC2030IDC = smd 0.783 x 0.783: 1 -0.953,-0.635; 2 -0.953,0.635; 3 0.317,-0.635; 4 0.317,0.635; 5 1.588,-0.635; 6 1.588,0.635 | hole 2.451: -2.223,-2.54; -2.223,2.54; 0.952,-2.54; 0.952,2.54 | hole 1.067: -2.223,0; 2.857,-1.016; 2.857,1.016
KH-TYPE-C-16P_KINGHELM_KH-TYPE-C-16P = smd 0.6 x 1.15: A1_B12 -3.2,4.725; A4_B9 -2.4,4.725; A9_B4 2.4,4.725; A12_B1 3.2,4.725 | smd 0.3 x 1.15: A5 -1.25,4.725; A6 -0.25,4.725; A7 0.25,4.725; A8 1.25,4.725; B5 1.75,4.725; B6 0.75,4.725; B7 -0.75,4.725; B8 -1.75,4.725 | drill 0.65 pad 1.05: SH1 -4.32,0; SH2 4.32,0; SH3 -4.32,4.15; SH4 4.32,4.15 | hole 0.7: -2.89,3.65; 2.89,3.65
NORDIC_NRF_2_RESC0402_L = smd 0.5 x 0.6: 1 -0.5,0; 2 0.5,0
ESP32_C6_LIBRARY_2_IND_4828-WE-TPC_WRE = smd 0.9 x 5.3: 1 -2.286,0; 2 2.286,0
MLP2016SR47MT0S1_INDC2016X100N = smd 1.2 x 2.2: 1 -1.028,0; 2 1.028,0
ESP32_C6_LIBRARY_4_ESP32_C6_LIBRARY_4_ESP32_C6_LIBRARY_4_ESP32_C6_LIBRARY_4_ESP32_WROVER_SPARKFUN-DISCRETESEMI_SOT23-3 = smd 0.8 x 0.9: 1 -0.95,-1; 2 0.95,-1; 3 0,1.1
ESP32_C6_LIBRARY_6_SOT65P210X110-3N = smd 1.05 x 0.5: 1 -1.05,0.65; 2 -1.05,-0.65; 3 1.05,0
CPF0201D7K68C1_0201 = smd 0.35 x 0.25: 1 0,0.275; 2 0,-0.275
ESP32_C6_LIBRARY_7_JUMPER_SJ = smd 1.168 x 1.6: 1 -0.762,0; 2 0.762,0
2025-10-22_07-23-44_LIBRARY_SW_EVP-AKE31A_PAN = smd 0.711 x 1.092: 1 -1.4,-0.972; 2 1.4,-0.972 | drill 0.559 pad 0.914 square: 3 -1.848,0.381; 4 1.848,0.381 | smd 1.397 x 1.092: 5 0,-1.124
HECTOR_WATCH_1_TP20R = smd 2 x 2: TP 0,0
ESP32_C6_LIBRARY_SON50P200X200X80-9N = smd 0.76 x 0.27: 1 -0.985,0.75; 2 -0.985,0.25; 3 -0.985,-0.25; 4 -0.985,-0.75; 5 0.985,-0.75; 6 0.985,-0.25; 7 0.985,0.25; 8 0.985,0.75 | smd 0.9 x 1.3: 9 0,0
NORDIC_NRF_4_AQFN50P700X700X85_HS-74N = smd 4.85 x 4.85: P$74 0,0 | drill 0.3 pad 0.6: P$75 -1.8,1.8; P$76 -0.6,1.8; P$77 0.6,1.8; P$78 1.8,1.8; P$79 -1.8,0.6; P$80 -0.6,0.6; P$81 0.6,0.6; P$82 1.8,0.6; P$83 -1.8,-0.6; P$84 -0.6,-0.6; P$85 0.6,-0.6; P$86 1.8,-0.6; P$87 -1.8,-1.8; P$88 -0.6,-1.8; P$89 0.6,-1.8; P$90 1.8,-1.8 | smd 0.2 x 0.2: P$A8 -1.25,3.25; P$A10 -0.75,3.25; P$A12 -0.25,3.25; P$A14 0.25,3.25; P$A16 0.75,3.25; P$A18 1.25,3.25; P$A20 1.75,3.25; P$A22 2.25,3.25; P$A23 2.75,3.25; P$AA24 3.25,-2.25; P$AB2 -2.75,-2.5; P$AC5 -2,-2.75; P$AC9 -1,-2.75; P$AC11 -0.5,-2.75; P$AC13 0,-2.75; P$AC15 0.5,-2.75; P$AC17 1,-2.75; P$AC19 1.5,-2.75; P$AC21 2,-2.75; P$AC24 3.25,-2.75; P$AD2 -2.75,-3.25; P$AD4 -2.25,-3.25; P$AD6 -1.75,-3.25; P$AD8 -1.25,-3.25; P$AD10 -0.75,-3.25; P$AD12 -0.25,-3.25; P$AD14 0.25,-3.25; P$AD16 0.75,-3.25; P$AD18 1.25,-3.25; P$AD20 1.75,-3.25; P$AD22 2.25,-3.25; P$AD23 2.75,-3.25; P$B1 -3.25,2.75; P$B3 -2.5,2.75; P$B5 -2,2.75; P$B7 -1.5,2.75; P$B9 -1,2.75; P$B11 -0.5,2.75; P$B13 0,2.75; P$B15 0.5,2.75; P$B17 1,2.75; P$B19 1.5,2.75; P$B24 3.25,2.75; P$C1 -3.25,2.25; P$D2 -2.75,2; P$D23 2.75,2; P$E24 3.25,1.75; P$F2 -2.75,1.5; P$F23 2.75,1.5; P$G1 -3.25,1.25; P$H2 -2.75,1; P$H23 2.75,1; P$J1 -3.25,0.75; P$J24 3.25,0.75; P$K2 -2.75,0.5; P$L1 -3.25,0.25; P$L24 3.25,0.25; P$M2 -2.75,0; P$N1 -3.25,-0.25; P$N24 3.25,-0.25; P$P2 -2.75,-0.5; P$P23 2.75,-0.5; P$R1 -3.25,-0.75; P$R24 3.25,-0.75; P$T2 -2.75,-1; P$T23 2.75,-1; P$U1 -3.25,-1.25; P$U24 3.25,-1.25; P$V23 2.75,-1.5; P$W1 -3.25,-1.75; P$W24 3.25,-1.75; P$Y2 -2.75,-2; P$Y23 2.75,-2
NORDIC_NRF_BT-XTAL_2016_N = smd 0.95 x 0.85: 1 -0.725,-0.575; 2 0.725,-0.575; 3 0.725,0.575; 4 -0.725,0.575
NORDIC_NRF_1_XTAL_3215_N = smd 1 x 1.8: 1 -1.25,0; 2 1.25,0

### Placement (x,y rotation side)
ANT1  3.12,27.17 0 top
C1  36.32,20.67 0 top
C1-EP-DR  5.84,7.97 0 top
C2  23.62,9.24 0 top
C2-EP-DR  3.3,7.97 0 top
C3  36.32,21.94 0 top
C4  2.03,29.56 0 top
C5  22.35,13.05 0 top
C6  41.4,27.02 0 top
C7  29.97,20.67 0 top
C8  29.97,19.4 0 top
C9  23.62,24.48 0 top
C10  37.59,29.56 0 top
C11  22.35,9.24 0 top
C12  29.97,18.13 0 top
C13  12.19,23.21 0 top
C14  38.86,4.16 0 top
C15  37.59,30.83 0 top
C16  24.89,9.24 0 top
C17  26.16,9.24 0 top
C18  29.97,16.86 0 top
C19  41.4,4.16 0 top
C20  29.97,11.78 0 top
C21  29.97,29.56 0 top
C22  4.57,29.56 0 top
C23  42.67,24.48 90 top
C24  37.59,28.29 0 top
C25  29.97,30.83 0 top
C27  42.67,25.75 90 top
C29  37.59,2.89 270 top
C30  8.38,0.68 0 top
C31  29.97,0.68 0 top
C32  31.15,0.68 0 top
C33  16,33.37 0 top
C34  40.13,2.89 270 top
C37  40.13,24.48 270 top
C38  29.97,10.51 270 top
C39  37.59,27.02 0 top
C42  33.78,28.29 180 top
C43  29.97,28.29 0 top
D2  5.84,4.16 0 top
D3  27.65,24.48 0 top
D4  10.92,5.43 0 top
D5  17.27,5.43 0 top
EPD_C1  17.27,20.67 0 top
EPD_C2  17.27,21.94 0 top
EPD_C5  19.81,13.05 0 top
EPD_C6  17.27,15.59 0 top
EPD_C7  17.27,14.32 0 top
EPD_C8  17.27,13.05 0 top
EPD_C9  17.27,11.78 0 top
EPD_C10  17.27,10.51 0 top
EPD_C11  10.92,7.97 0 top
EPD_C12  8.38,7.97 0 top
IC1  27.43,24.48 180 top
IC2  28.7,2.89 180 top
IC3  40.26,21.18 0 top
IC9  33.78,30.83 0 top
J1  8.9,16.86 270 top
J2  36.32,13.05 270 top
J3  23.62,33.37 180 top
L1  29.97,15.59 0 top
L2  29.97,14.32 0 top
L3  29.97,13.05 0 top
L5  9.65,28.29 0 top
L7  40.13,29.56 270 top
Q1  14.73,27.02 90 top
Q3  16,30.83 0 top
R1_EP_DR  16,24.48 270 top
R1_USB  25.64,27.77 90 top
R2  32.51,28.29 180 top
R2_EP_DR  14.73,24.48 90 top
R2_USB  23.62,27.77 90 top
R3  41.4,19.4 270 top
R4  40.13,25.75 90 top
R5  40.13,19.4 90 top
R7  38.86,2.89 270 top
R8  28.7,0.68 180 top
R9  24.89,27.02 90 top
R17  41.4,24.48 90 top
R18  41.4,25.75 270 top
R_PWR_EPD  23.62,23.21 270 top
R_TYPE_SEL  17.27,24.96 90 top
SJ1  12.19,33.37 0 top
SW_DN  33.78,2.99 180 top
SW_ENT  22.35,2.99 180 top
SW_UP  11.94,3.23 180 top
TP_3.3V  37.59,33.37 0 top
TP_3V3  40.13,33.37 0 top
TP_BAT_GND  42.67,32.1 0 top
TP_GND  44.46,29.36 0 top
TP_ON  38.78,1.29 0 top
TP_OP  41.28,1.87 0 top
TP_RESET  44.66,6.73 0 top
TP_SCL  44.72,25.75 0 top
TP_SDA  43.89,4.19 0 top
TP_SWDCLK  44.72,9.24 0 top
TP_SWDIO  44.72,11.78 0 top
TP_SWO  44.72,14.32 0 top
TP_VBAT  44.72,23.21 0 top
TP_VREG  44.72,20.67 0 top
U3  33.78,24.48 0 top
U$1  22.35,18.13 90 top
X1  21.08,25.75 0 top
X2  26.16,11.78 0 top

### Tracks (layer width: path | path; a pad name or v marks a point on that pad's centre or on a via)
3V3  (13 unrouted)
  Top 0.127: R7.2 38.48,2.89 38.48,4.16 C14.1 | C25.1 28.95,30.83 27.05,32.73 27.05,34 27.56,34.51 36.45,34.51 TP_3.3V.TP TP_3V3.TP | U$1.P$W1 24.13,14.95 24.13,15.21 24.26,15.34 U$1.P$Y2 24.38,15.34 24.89,14.83 26.29,14.83 29.59,18.13 C12.1 C8.1 | C8.1 C7.1 | C8.1 | 40.13,19.02 40.38,19.27 40.38,19.4 R5.2 | 40.13,19.02 39.62,19.02 39.24,19.4 | 39.24,19.4 39.11,19.53 39.11,21.69 39.5,22.07 IC3.10 | 40.13,19.02 40.13,18 41.65,16.48 C19.2 | J2.1 35.69,14.7 35.43,14.95 35.43,15.59 39.24,19.4 | IC3.7 41.02,22.07 41.02,24.48 R17.1 | IC9.E2 33.78,30.07 34.16,30.07 IC9.E3 34.16,29.94 34.16,29.18 36.57,26.77 36.57,26.64 36.7,26.51 40.38,26.51 C6.1 41.02,27.02 41.65,26.38 41.65,25.75 R18.1 | U$1.P$AD14 25.65,18.38 25.91,18.64 25.91,20.54 25.65,20.8 U$1.P$AD23 25.65,20.92 25.65,22.07 23.87,23.84 | 23.87,23.84 23.24,23.21 R_PWR_EPD.2 | 23.87,23.84 24.26,24.23 24.26,24.73 24,24.99 23.24,24.99 22.98,24.73 22.98,24.23 19.18,20.42 U$1.P$A22
ALERT  (1 unrouted)
D+
  Top 0.127: U$1.P$AD6 25.65,16.35 28.83,19.53 28.83,23.46 D3.4
D-
  Top 0.127: U$1.P$AD4 25.65,15.84 29.08,19.27 29.08,22.45 29.72,23.08 29.72,24.86 29.21,25.37 28.95,25.37 D3.6
DEC1
  Top 0.127: C5.1 21.84,13.05 20.06,14.83 U$1.P$C1
DEC3  (1 unrouted)
DEC4_6  (4 unrouted)
  Top 0.127: C16.1 24.64,9.11 25.27,8.48 28.83,8.48 30.99,10.64 30.99,12.54 L3.2
DN
  Top 0.127: J3.A7 23.49,28.67 23.49,29.31 23.62,29.43 24.13,29.43 24.26,29.31 24.26,28.67 J3.B7 24.26,28.54 24.26,26.77 25.52,25.5 26.29,25.5 D3.1
DP  (2 unrouted)
EPD_3V3
  Top 0.127: C1-EP-DR.1 5.46,7.97 5.46,8.35 6.6,9.49 8.25,9.49 9.78,11.02 9.78,14.83 10.03,15.08 10.41,15.08 J1.16 10.41,15.21 10.41,15.59 J1.15 | 13.21,27.02 Q1.3 | L5.2 13.21,27.02 | EPD_C5.1 19.3,13.94 18.29,14.95 18.29,15.97 18.16,16.1 11.3,16.1 10.92,15.72 10.54,15.72 J1.15 | 13.21,27.02 13.21,26.26 9.78,22.83 9.78,15.97 10.03,15.72 10.41,15.72 J1.15
EPD_BUSY  (1 unrouted)
EPD_CS  (1 unrouted)
EPD_DC  (1 unrouted)
EPD_RST  (1 unrouted)
GDR  (2 unrouted)
GND  (6 unrouted)
  Top 0.127: C43.2 C21.2 | 33.02,25.37 32.89,25.24 U3.1 | 33.02,25.37 33.27,25.62 | 33.27,25.62 34.16,26.51 34.16,28.29 33.91,28.54 33.78,28.54 C42.2 | C43.2 33.14,25.62 33.27,25.62 | C43.2 | 38.1,27.53 C24.2 | 38.1,27.53 C39.2 | 42.29,25.75 42.29,26.64 C6.2 41.78,27.02 41.27,27.53 | 41.27,27.53 38.1,27.53 | 40.51,24.48 40.89,24.86 41.91,24.86 42.29,24.48 C23.1 | 40.51,24.48 40.51,24.1 | 40.51,24.1 40.51,22.07 IC3.8 40.38,21.94 40.13,21.94 IC3.9 40,22.07 39.62,22.45 36.57,22.45 | 40.51,24.48 C37.1 | C3.2 C1.2 | 33.78,24.35 33.27,23.84 32.89,23.84 U3.4 | 33.78,24.35 34.67,24.35 U3.6 34.8,24.23 35.05,24.23 36.57,22.7 36.57,22.45 | 33.78,24.35 U3.9 33.78,24.61 33.02,25.37 | 36.57,22.45 C3.2 | C3.2 | 42.29,25.75 41.91,25.37 40.13,25.37 39.5,24.73 39.5,24.23 39.62,24.1 40.51,24.1 | 42.29,25.75 C27.1 | 42.67,31.97 42.67,31.21 44.45,29.43 TP_GND.TP | 37.34,30.2 C10.1 | 37.84,30.7 37.97,30.83 C15.2 37.84,30.7 | 37.84,30.7 37.34,30.2 | 33.4,30.83 33.4,31.21 IC9.B1 | 33.4,30.83 IC9.C2 34.16,30.83 IC9.C3 35.69,30.83 36.32,30.2 37.34,30.2 | 33.02,30.83 IC9.C1 33.4,30.83 | 33.02,30.83 C25.2 30.35,30.83 28.06,33.12 28.06,33.37 J3.SH1 | 42.67,31.97 33.27,31.97 33.02,31.72 33.02,30.83 | 42.67,31.97 TP_BAT_GND.TP | 41.27,27.53 41.53,27.78 41.53,29.18 41.02,29.69 38.86,29.69 37.84,30.7 | C8.2 C7.2 | C8.2 C12.2 30.35,18.13 29.72,17.49 C18.1 29.59,16.86 29.08,16.35 28.95,16.35 28.45,15.84 28.45,11.91 29.08,11.27 30.35,11.27 | C8.2 | 30.35,11.78 30.35,11.27 | 30.35,11.27 30.35,10.51 C38.1 30.22,10.51 30.22,10.38 28.57,8.73 26.29,8.73 25.78,9.24 | 25.78,9.24 C16.2 25.14,9.37 24.76,9.75 24.51,9.75 24,9.24 | 22.6,9.75 23.49,9.75 24,9.24
  Top 0.127: 22.6,9.75 22.48,9.75 22.1,9.37 C11.1 | 22.6,9.75 C5.2 | 24,9.24 C2.2 | 25.78,9.24 C17.1 | 40.51,3.65 40.51,2.89 C34.1 | 41.02,4.16 40.51,3.65 | 41.02,4.16 41.53,3.65 41.78,3.65 42.03,3.91 42.03,16.48 41.78,16.73 41.78,19.4 R3.1 | 41.02,4.16 C19.1 | 40.51,3.65 40,4.16 C14.2 39.24,4.16 39.24,4.54 36.45,7.33 | 36.45,7.33 36.45,10.26 35.69,11.02 J2.5 J2.3 35.69,12.8 34.8,13.68 33.14,13.68 31.75,15.08 | 30.35,11.78 29.59,12.54 29.08,12.54 28.95,12.67 28.95,14.7 29.34,15.08 31.75,15.08 | 30.35,11.78 C20.2 | C1.2 36.57,20.29 31.75,15.46 31.75,15.08 | C1.2 | 27.3,26.64 27.3,28.16 27.05,28.42 | 27.3,26.64 27.3,25.5 | 27.3,25.5 27.3,25.11 IC1.D2 | 27.05,28.42 26.92,28.54 J3.A1_B12 27.05,28.42 | 27.3,26.64 24.89,26.64 24.64,26.89 24.64,27.02 R9.1 | 27.05,28.42 27.18,28.42 27.94,29.18 J3.SH3 | C13.2 12.57,23.21 13.84,24.48 R2_EP_DR.1 14.48,24.48 14.48,24.35 14.98,23.84 20.7,23.84 21.71,24.86 21.71,25.11 X1.2 21.84,25.11 23.11,26.38 | 23.11,26.38 23.62,26.89 | 23.62,26.89 23.87,27.15 23.87,27.66 R2_USB.2 | 26.03,24.48 D3.2 | 23.62,26.89 26.03,24.48 | 27.3,25.5 27.68,25.5 27.94,25.24 27.94,23.72 27.18,22.96 25.78,22.96 25.52,23.21 25.52,23.97 26.03,24.48 | 3.05,26.77 3.81,27.53 3.81,28.42 4.95,29.56 | 3.05,26.77 2.28,26 1.01,26 0.76,26.26 0.76,29.18 1.65,30.07 1.9,30.07 2.28,29.69 C4.2 | 3.05,26.77 3.81,26 5.97,26 7.74,24.23 7.74,23.46 J1.MP1 7.87,23.34 7.87,10.38 J1.MP2 7.74,10.26 6.22,10.26 4.32,8.35 | 18.16,26.26 17.02,25.11 17.02,24.99 R_TYPE_SEL.1 | 18.16,26.26 20.32,26.26 X1.4 | 14.22,34.39 15.37,34.39 16.38,33.37 C33.2 J3.SH2 19.3,29.31 J3.SH4 19.3,29.18 19.81,28.67 20.32,28.67 J3.A12_B1 20.45,28.54 20.45,28.16 20.83,27.78 21.71,27.78 23.11,26.38
  Top 0.127: 14.22,34.39 12.19,34.39 11.43,33.62 SJ1.1 9.02,33.37 5.21,29.56 4.95,29.56 | 18.16,26.26 18.16,26.77 15.24,29.69 14.35,29.69 14.22,29.81 14.22,34.39 | 4.95,29.56 C22.2 | 13.46,4.29 13.46,5.94 13.33,6.06 9.9,6.06 9.27,5.43 D4.1 9.14,5.43 9.14,4.41 8.25,3.52 6.86,3.52 3.3,7.08 3.3,8.48 | 3.3,8.48 4.19,8.48 4.32,8.35 | 3.3,8.48 2.41,8.48 2.28,8.35 2.28,4.67 5.97,0.98 8.38,0.98 C30.1 | 4.32,8.35 4.57,8.1 4.57,7.46 4.82,7.21 5.84,7.21 6.22,7.59 | 6.22,7.59 6.22,7.97 C1-EP-DR.2 | 8.76,7.59 8.76,7.97 EPD_C12.2 | 8.76,7.59 8.38,7.21 6.6,7.21 6.22,7.59 | 8.76,7.59 9.14,7.21 10.92,7.21 11.3,7.59 11.3,7.97 EPD_C11.2 | 27.56,2 26.16,2 24.26,3.91 23.87,3.91 SW_ENT.1 23.75,4.03 23.75,4.54 21.84,6.45 | 27.56,2 28.32,2 29.34,0.98 29.97,0.98 C31.1 | EPD_C9.2 EPD_C10.2 | EPD_C7.2 EPD_C8.2 | EPD_C7.2 EPD_C6.2 | EPD_C7.2 | 20.19,13.05 19.68,12.54 18.29,12.54 | EPD_C8.2 18.29,12.54 | EPD_C8.2 | EPD_C9.2 17.78,12.03 18.29,12.54 | EPD_C9.2 | 20.45,16.35 20.19,16.61 19.68,16.61 U$1.P$B7 19.56,16.61 19.05,16.1 19.05,14.57 20.19,13.43 20.19,13.05 | 20.57,20.04 20.83,20.29 20.83,20.8 U$1.P$F23 | 20.45,16.35 U$1.P$75 | 20.45,16.35 U$1.P$74 | 21.08,16.99 20.57,17.49 U$1.P$76 | 21.21,19.4 20.57,18.76 U$1.P$77 | 20.57,20.04 U$1.P$78 | 20.57,20.04 U$1.P$74 | 21.08,16.99 21.71,16.35 U$1.P$79 21.84,16.35 22.86,16.35 U$1.P$83 22.98,16.35 24.13,16.35 U$1.P$87 | 21.08,16.99 U$1.P$74 | U$1.P$80 U$1.P$74 | U$1.P$74 U$1.P$84 | U$1.P$81 21.84,18.76 U$1.P$74 | U$1.P$74 U$1.P$85 | 21.21,19.4 21.71,19.91 U$1.P$82 21.84,20.04 22.86,20.04 U$1.P$86 22.98,20.04 24.13,20.04 U$1.P$90 | 21.21,19.4 U$1.P$74 | 24.13,18.64 24.13,17.62 U$1.P$88
  Top 0.127: 24.13,18.64 U$1.P$89 | 24.13,18.64 U$1.P$74 | 20.19,13.05 EPD_C5.2 | EPD_C10.2 21.84,6.45 | EPD_C10.2 | 13.46,4.29 19.68,4.29 21.84,6.45 | 13.46,4.29 SW_UP.1 | 36.45,7.33 31.24,7.33 27.56,3.65 27.56,2 | 29.59,2.51 31.11,0.98 C32.1 | 29.59,2.51 IC2.B1 | C29.1 37.84,2.89 37.84,3.02 36.95,3.91 35.3,3.91 SW_DN.1 35.18,4.03 35.18,4.29 34.54,4.92 32,4.92 29.59,2.51 | EPD_C2.2 EPD_C1.2 17.65,20.67 16.13,19.15 10.54,19.15 J1.8
HAPTIC_EN  (1 unrouted)
IMU_INT1  (1 unrouted)
IMU_INT2  (1 unrouted)
LX1
  Top 0.127: 34.16,31.21 33.78,31.21 IC9.B2 | 34.16,31.21 36.57,31.21 36.7,31.34 39.5,31.34 40.13,30.7 L7.1 | 34.16,31.21 IC9.B3
LX2
  Top 0.127: 34.16,30.45 33.78,30.45 IC9.D2 | 34.16,30.45 35.69,30.45 37.34,28.8 39.88,28.8 40.13,28.54 L7.2 | 34.16,30.45 IC9.D3
MOSI  (1 unrouted)
N$1  (2 unrouted)
N$2  (2 unrouted)
N$3  (1 unrouted)
N$4
  Top 0.127: IC9.D1 33.4,30.45 33.27,30.45 32.13,29.31 32.13,27.78 32.26,27.66 32.76,27.66 33.4,28.29 33.4,28.8 33.53,28.92 34.03,28.92 36.32,26.64 36.32,26.51 36.7,26.13 40.13,26.13 40.51,25.75 R4.2
N$5  (2 unrouted)
N$6
  Top 0.127: U$1.P$AC5 25.14,16.1 25.14,15.34 25.4,15.08 25.78,15.08 29.34,18.64 29.34,20.92 29.59,21.18 30.35,21.18 30.61,20.92 30.61,16.61 30.1,16.1 29.08,16.1 28.7,15.72 28.7,12.54 C20.1
N$7
  Top 0.127: U$1.P$B3 19.56,15.59 19.56,15.34 19.3,15.08 19.3,14.7 20.45,13.56 20.7,13.56 21.71,12.54 21.71,8.99 22.48,8.22 28.95,8.22 31.24,10.51 31.24,14.45 30.86,14.83 30.1,14.83 29.59,14.32 L2.1
N$8
  Top 0.127: U$1.P$N24 22.6,21.43 22.6,23.46 23.24,24.1 23.24,24.48 C9.1
N$9
  Top 0.127: IC9.E1 33.4,29.94 33.4,29.56 32.51,28.67 R2.2
N$10
  Top 0.127: R3.2 41.02,19.4 40.64,19.78 40,19.78 39.5,20.29 IC3.1
N$11
  Top 0.127: L3.1 29.59,13.05 29.59,13.56 30.35,14.32 L2.2
N$12
  Top 0.127: C2-EP-DR.1 2.92,7.97 2.92,5.3 4.06,4.16 D2.1 4.19,4.16 5.08,3.27 8.38,3.27 10.54,5.43 D4.2
N$13  (1 unrouted)
  Top 0.127: 11.94,6.57 13.59,6.57 14.73,5.43 14.73,4.92 14.86,4.79 18.29,4.79 18.92,5.43 D5.2 | 11.94,6.57 5.08,6.57 4.32,7.33 4.32,7.46 C2-EP-DR.2 | L5.1 7.36,24.99 8.51,23.84 8.51,10.13 8.13,9.75 6.22,9.75 4.82,8.35 4.82,7.59 4.95,7.46 5.71,7.46 5.84,7.59 5.84,8.35 5.97,8.48 6.73,8.48 7.36,7.84 7.36,7.59 7.49,7.46 8.25,7.46 8.38,7.59 8.38,8.35 8.51,8.48 9.27,8.48 9.9,7.84 9.9,7.59 10.03,7.46 10.79,7.46 10.92,7.59 10.92,8.35 11.05,8.48 11.81,8.48 11.94,8.35 11.94,6.57
N$14
  Top 0.127: R_TYPE_SEL.2 17.52,24.86 17.14,24.48 R1_EP_DR.1 16.25,24.48 16.25,24.61 15.49,25.37 15.24,25.37 14.35,26.26 14.35,29.31 12.95,30.7 SJ1.2
N$15
  Top 0.127: IC2.A2 29.72,1.37 30.22,1.37 30.73,0.86 30.73,0.73 31.11,0.35 C32.2
N$16
  Top 0.127: EPD_C2.1 11.55,21.94 10.79,21.18 10.54,21.18 J1.4
N$17
  Top 0.127: EPD_C1.1 10.54,20.67 J1.5
N$18
  Top 0.127: EPD_C7.1 11.43,14.32 10.79,13.68 10.54,13.68 J1.19
N$19
  Top 0.127: EPD_C6.1 12.19,15.59 10.79,14.19 10.54,14.19 J1.18
N$20
  Top 0.127: EPD_C8.1 10.54,13.05 J1.20
N$21
  Top 0.127: U$1.P$A18 19.05,19.4 18.29,20.16 18.29,22.32 17.91,22.7 12.32,22.7 11.81,23.21 C13.1
N$22
  Top 0.127: R2_USB.1 23.24,27.78 22.22,27.78 21.97,28.04 21.97,28.54 J3.B5
N$23
  Top 0.127: EPD_C10.1 12.32,10.51 10.79,12.03 10.54,12.03 J1.22
N$24
  Top 0.127: R1_USB.2 25.91,27.66 25.65,27.4 25.14,27.4 24.89,27.66 24.89,28.54 J3.A5
N$25
  Top 0.127: EPD_C12.1 8,7.97 8,8.6 10.41,11.02 J1.24
OUT+
  Top 0.127: IC2.A3 28.19,2.51 28.06,2.51 27.81,2.76 27.81,3.52 29.72,5.43 37.97,5.43 38.86,4.54 38.86,3.78 39.5,3.14 39.5,2.64 40.26,1.87 TP_OP.TP
OUT-
  Top 0.127: IC2.C3 28.32,3.4 28.32,3.52 29.97,5.18 36.19,5.18 38.23,3.14 38.23,1.87 38.73,1.37 TP_ON.TP
P0.00/XL1
  Top 0.127: 27.3,11.78 25.52,13.56 21.97,13.56 20.45,15.08 20.45,15.34 U$1.P$D2 | 27.3,11.78 26.54,11.02 26.54,9.24 C17.2 | 27.3,11.78 X2.2
P0.01/XL2  (2 unrouted)
P0.13  (2 unrouted)
  Top 0.127: C30.2 8.38,0.48 8.51,0.48 9.14,1.11 9.14,3.27 10.03,4.16 10.41,4.16 SW_UP.2
P0.14  (2 unrouted)
  Top 0.127: R8.1 28.7,0.48 29.97,0.48 C31.2
P1.01  (1 unrouted)
  Top 0.127: U$1.P$Y23 24.38,20.92 25.14,20.92 25.4,21.18 25.4,21.81 24,23.21 R_PWR_EPD.1
P1.02  (3 unrouted)
PMIC_INT  (1 unrouted)
PREVGH
  Top 0.127: 10.54,8.73 10.54,10.38 11.05,10.89 11.05,11.27 10.79,11.53 10.54,11.53 J1.23 | 10.54,8.73 10.54,7.97 EPD_C11.1 | D5.1 15.24,5.43 11.94,8.73 10.54,8.73
PREVGL
  Top 0.127: J1.21 10.54,12.54 10.79,12.54 11.55,11.78 EPD_C9.1 16.89,11.78 17.27,11.4 17.27,10.13 19.81,7.59 19.81,4.92 19.43,4.54 14.73,4.54 14.48,4.79 14.48,5.3 13.46,6.32 8.76,6.32 7.62,5.18 7.62,4.16 D2.2
RE
  Top 0.127: 1.65,29.05 1.65,27.27 ANT1.1 | 1.65,29.05 1.65,29.56 C4.1 | 4.19,29.56 2.92,29.56 2.41,29.05 1.65,29.05 | 4.19,29.56 9.27,34.64 24.13,34.64 28.83,29.94 28.83,28.04 30.86,26 30.86,16.48 30.48,16.1 L1.2 | 4.19,29.56 C22.1
RESE
  Top 0.127: 15.62,24.48 15.24,24.86 12.95,24.86 11.05,22.96 11.05,21.94 10.79,21.69 10.54,21.69 J1.3 | 15.62,24.48 16,24.1 20.57,24.1 21.08,24.61 21.08,26.89 20.95,27.02 19.81,27.02 16.76,30.07 14.98,30.07 Q3.2 | 15.62,24.48 R1_EP_DR.2
RESET  (2 unrouted)
SCK
  Top 0.127: U$1.P$A12 19.05,17.88 12.06,17.88 10.92,16.73 10.54,16.73 J1.13
SCL  (6 unrouted)
  Top 0.127: R4.1 36.07,25.75 35.05,24.73 34.8,24.73 U3.7
SDA  (6 unrouted)
  Top 0.127: IC3.2 40.13,20.29 40.13,20.16 40.26,20.04 41.65,20.04 43.43,18.26 43.43,4.67 43.81,4.29 TP_SDA.TP
SWDCLK  (2 unrouted)
SWDIO  (2 unrouted)
SWO  (1 unrouted)
VBAT  (3 unrouted)
  Top 0.127: U3.3 32.89,24.35 32.89,24.61 U3.2 | C37.2 39.88,24.48 39.88,24.61 40.38,25.11 42.42,25.11 43.05,25.75 C27.2
VBUS  (5 unrouted)
  Top 0.127: J3.A9_B4 21.33,28.67 21.33,29.18 21.84,29.69 25.4,29.69 25.91,29.18 25.91,28.67 J3.A4_B9 | 29.59,29.56 30.1,30.07 30.86,30.07 30.99,29.94 30.99,28.54 32.13,27.4 32.89,27.4 33.4,27.91 33.78,27.91 C42.1 | 29.59,29.56 29.59,28.29 C43.1 | 29.59,29.56 C21.1
VREG  (2 unrouted)
  Top 0.127: 33.78,31.59 33.4,31.59 IC9.A1 | 33.78,31.59 34.16,31.59 | 33.78,31.59 IC9.A2 | 43.05,24.48 43.05,22.32 44.7,20.67 TP_VREG.TP | 34.16,31.59 41.15,31.59 43.18,29.56 43.18,26.13 43.3,26 43.3,24.73 43.05,24.48 | 34.16,31.59 IC9.A3 | 43.05,24.48 C23.2 | C39.1 37.21,27.02 37.21,28.29 C24.1